# Altium schematic sheet atxmega64.SchDoc
size B
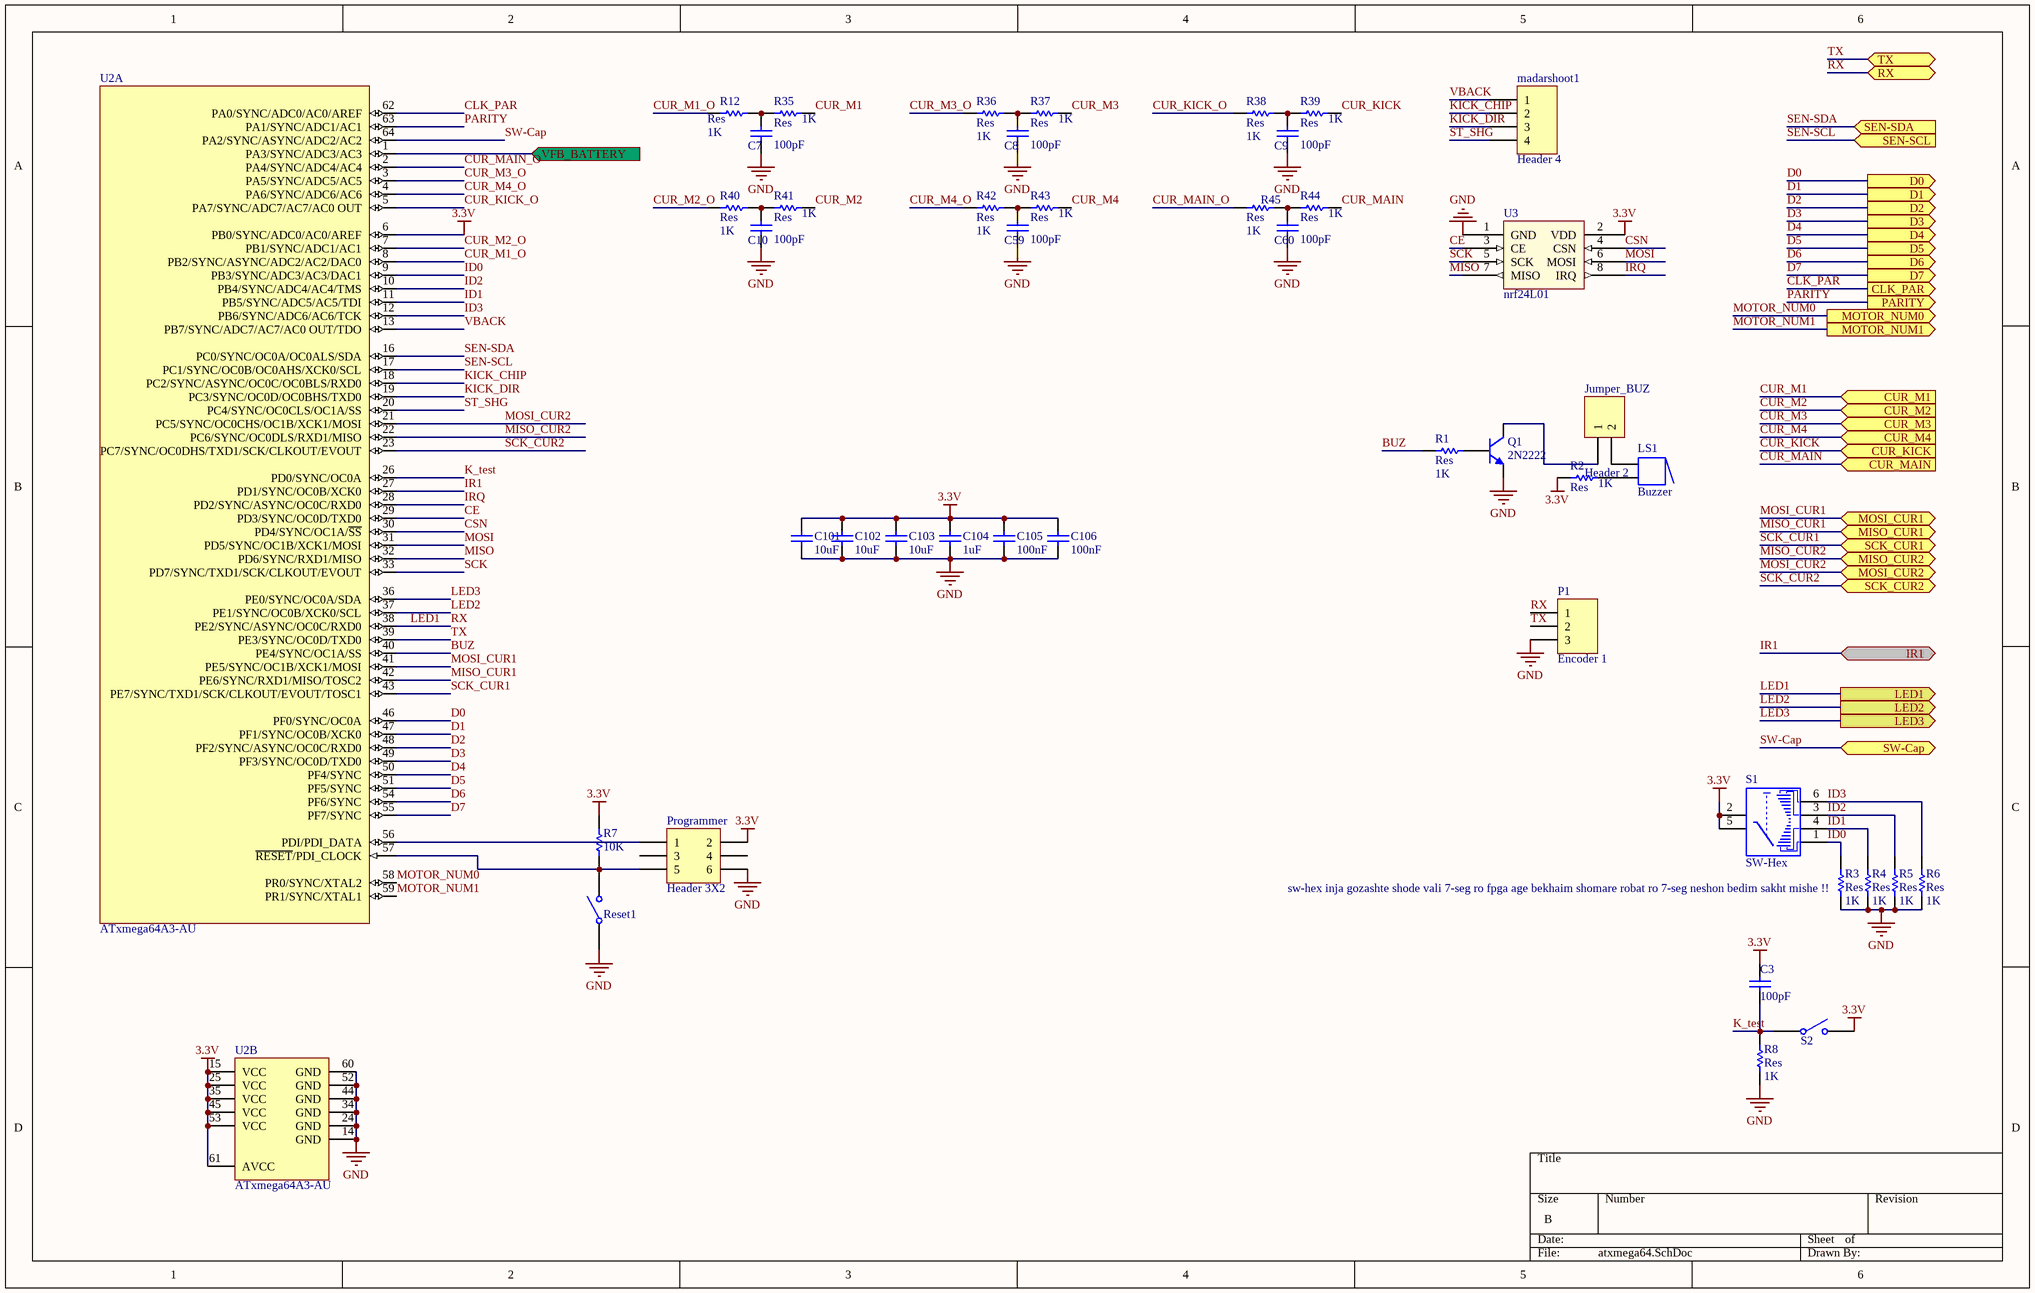
[diagram p0: atxmega64.SchDoc]

## Parts
C3  value 100pF  [2012[0805]]  (hidden comment: Cap_UP)
C7  value 100pF  [2012[0805]]  (hidden comment: Cap_UP)
C8  value 100pF  [2012[0805]]  (hidden comment: Cap_UP)
C9  value 100pF  [2012[0805]]  (hidden comment: Cap_UP)
C10  value 100pF  [2012[0805]]  (hidden comment: Cap_UP)
C59  value 100pF  [2012[0805]]  (hidden comment: Cap_UP)
C60  value 100pF  [2012[0805]]  (hidden comment: Cap_UP)
C101  value 10uF  [2012[0805]]  (hidden comment: Cap_UP)
C102  value 10uF  [2012[0805]]  (hidden comment: Cap_UP)
C103  value 10uF  [2012[0805]]  (hidden comment: Cap_UP)
C104  value 1uF  [2012[0805]]  (hidden comment: Cap_UP)
C105  value 100nF  [2012[0805]]  (hidden comment: Cap_UP)
C106  value 100nF  [2012[0805]]  (hidden comment: Cap_UP)
Jumper_BUZ  Header 2  [HDR1X2]
LS1  Buzzer  [BUZZER]
madarshoot1  Header 4  [sucket-smd-4pin]
P1  Encoder 1  [HDR1X3A]
Programmer  Header 3X2  [HDRBOX2X3]
Q1  2N2222  [SOT-23]
R1  Res  value 1K  [2012[0805]]
R2  Res  value 1K  [2012[0805]]
R3  Res  value 1K  [2012[0805]]
R4  Res  value 1K  [2012[0805]]
R5  Res  value 1K  [2012[0805]]
R6  Res  value 1K  [2012[0805]]
R7  10K  [2012[0805]]
R8  Res  value 1K  [2012[0805]]
R12  Res  value 1K  [2012[0805]]
R35  Res  value 1K  [2012[0805]]
R36  Res  value 1K  [2012[0805]]
R37  Res  value 1K  [2012[0805]]
R38  Res  value 1K  [2012[0805]]
R39  Res  value 1K  [2012[0805]]
R40  Res  value 1K  [2012[0805]]
R41  Res  value 1K  [2012[0805]]
R42  Res  value 1K  [2012[0805]]
R43  Res  value 1K  [2012[0805]]
R44  Res  value 1K  [2012[0805]]
R45  Res  value 1K  [2012[0805]]
Reset1  SW-SPST  [PUSH-BUT]  (value not drawn)
S1  SW-Hex  [SW-HEX]
S2  SW-SPST  [PUSH-BUT]  (value not drawn)
U2  ATxmega64A3-AU  [64A_N]  (parts A,B of 2)
U3  nrf24L01  [NRF24L01]

## Ports
CLK_PAR (out), CUR_KICK (in), CUR_M1 (in), CUR_M2 (in), CUR_M3 (in), CUR_M4 (in), CUR_MAIN (in), D0 (out), D1 (out), D2 (out), D3 (out), D4 (out), D5 (out), D6 (out), D7 (out), IR1, LED1 (out), LED2 (out), LED3 (out), MISO_CUR1, MISO_CUR2, MOSI_CUR1, MOSI_CUR2, MOTOR_NUM0 (out), MOTOR_NUM1 (out), PARITY (out), RX, SCK_CUR1, SCK_CUR2, SEN-SCL (in), SEN-SDA (in), SW-Cap, TX, VFB_BATTERY (in)

## Nets
3.3V: C3.2 C101.2 C102.2 C103.2 C104.2 C105.2 C106.2 Programmer.2 R2.1 R7.1 S1.2 S1.5 S2.2(NO) U2.6(PB0/SYNC/ADC0/AC0/AREF) U2.15(VCC) U2.25(VCC) U2.35(VCC) U2.45(VCC) U2.53(VCC) U2.61(AVCC) U3.2(VDD)
GND: C7.1 C8.1 C9.1 C10.1 C59.1 C60.1 C101.1 C102.1 C103.1 C104.1 C105.1 C106.1 P1.3 Programmer.6 Q1.3(E) R3.1 R4.1 R5.1 R6.1 R8.2 Reset1.1(COMMON) U2.14(GND) U2.24(GND) U2.34(GND) U2.44(GND) U2.52(GND) U2.60(GND) U3.1(GND)
BUZ: R1.1 U2.40(PE4/SYNC/OC1A/SS)
CE: U2.29(PD3/SYNC/OC0D/TXD0) U3.3(CE)
CLK_PAR: U2.62(PA0/SYNC/ADC0/AC0/AREF) ; port CLK_PAR
CSN: U2.30(PD4/SYNC/OC1A/~{SS}) U3.4(CSN)
CUR_KICK: R39.2 ; port CUR_KICK
CUR_KICK_O: R38.1 U2.5(PA7/SYNC/ADC7/AC7/AC0_OUT)
CUR_M1: R35.2 ; port CUR_M1
CUR_M1_O: R12.1 U2.8(PB2/SYNC/ASYNC/ADC2/AC2/DAC0)
CUR_M2: R41.2 ; port CUR_M2
CUR_M2_O: R40.1 U2.7(PB1/SYNC/ADC1/AC1)
CUR_M3: R37.2 ; port CUR_M3
CUR_M3_O: R36.1 U2.3(PA5/SYNC/ADC5/AC5)
CUR_M4: R43.2 ; port CUR_M4
CUR_M4_O: R42.1 U2.4(PA6/SYNC/ADC6/AC6)
CUR_MAIN: R44.2 ; port CUR_MAIN
CUR_MAIN_O: R45.1 U2.2(PA4/SYNC/ADC4/AC4)
D0: U2.46(PF0/SYNC/OC0A) ; port D0
D1: U2.47(PF1/SYNC/OC0B/XCK0) ; port D1
D2: U2.48(PF2/SYNC/ASYNC/OC0C/RXD0) ; port D2
D3: U2.49(PF3/SYNC/OC0D/TXD0) ; port D3
D4: U2.50(PF4/SYNC) ; port D4
D5: U2.51(PF5/SYNC) ; port D5
D6: U2.54(PF6/SYNC) ; port D6
D7: U2.55(PF7/SYNC) ; port D7
ID0: R3.2 S1.1 U2.9(PB3/SYNC/ADC3/AC3/DAC1)
ID1: R4.2 S1.4 U2.11(PB5/SYNC/ADC5/AC5/TDI)
ID2: R5.2 S1.3 U2.10(PB4/SYNC/ADC4/AC4/TMS)
ID3: R6.2 S1.6 U2.12(PB6/SYNC/ADC6/AC6/TCK)
IR1: U2.27(PD1/SYNC/OC0B/XCK0) ; port IR1
IRQ: U2.28(PD2/SYNC/ASYNC/OC0C/RXD0) U3.8(IRQ)
K_test: C3.1 R8.1 S2.1(COMMON) U2.26(PD0/SYNC/OC0A)
KICK_CHIP: madarshoot1.2 U2.18(PC2/SYNC/ASYNC/OC0C/OC0BLS/RXD0)
KICK_DIR: madarshoot1.3 U2.19(PC3/SYNC/OC0D/OC0BHS/TXD0)
LED1: P1.1 U2.38(PE2/SYNC/ASYNC/OC0C/RXD0) ; port LED1, port RX  [also labelled RX]
LED2: U2.37(PE1/SYNC/OC0B/XCK0/SCL) ; port LED2
LED3: U2.36(PE0/SYNC/OC0A/SDA) ; port LED3
MISO: U2.32(PD6/SYNC/RXD1/MISO) U3.7(MISO)
MISO_CUR1: U2.42(PE6/SYNC/RXD1/MISO/TOSC2) ; port MISO_CUR1
MISO_CUR2: U2.22(PC6/SYNC/OC0DLS/RXD1/MISO) ; port MISO_CUR2
MOSI: U2.31(PD5/SYNC/OC1B/XCK1/MOSI) U3.6(MOSI)
MOSI_CUR1: U2.41(PE5/SYNC/OC1B/XCK1/MOSI) ; port MOSI_CUR1
MOSI_CUR2: U2.21(PC5/SYNC/OC0CHS/OC1B/XCK1/MOSI) ; port MOSI_CUR2
MOTOR_NUM0: U2.58(PR0/SYNC/XTAL2) ; port MOTOR_NUM0
MOTOR_NUM1: U2.59(PR1/SYNC/XTAL1) ; port MOTOR_NUM1
PARITY: U2.63(PA1/SYNC/ADC1/AC1) ; port PARITY
SCK: U2.33(PD7/SYNC/TXD1/SCK/CLKOUT/EVOUT) U3.5(SCK)
SCK_CUR1: U2.43(PE7/SYNC/TXD1/SCK/CLKOUT/EVOUT/TOSC1) ; port SCK_CUR1
SCK_CUR2: U2.23(PC7/SYNC/OC0DHS/TXD1/SCK/CLKOUT/EVOUT) ; port SCK_CUR2
SEN-SCL: U2.17(PC1/SYNC/OC0B/OC0AHS/XCK0/SCL) ; port SEN-SCL
SEN-SDA: U2.16(PC0/SYNC/OC0A/OC0ALS/SDA) ; port SEN-SDA
ST_SHG: madarshoot1.4 U2.20(PC4/SYNC/OC0CLS/OC1A/SS)
SW-Cap: U2.64(PA2/SYNC/ASYNC/ADC2/AC2) ; port SW-Cap
TX: P1.2 U2.39(PE3/SYNC/OC0D/TXD0) ; port TX
VBACK: madarshoot1.1 U2.13(PB7/SYNC/ADC7/AC7/AC0_OUT/TDO)
VFB_BATTERY: U2.1(PA3/SYNC/ADC3/AC3) ; port VFB_BATTERY
NetC7_2: C7.2 R12.2 R35.1
NetC8_2: C8.2 R36.2 R37.1
NetC9_2: C9.2 R38.2 R39.1
NetC10_2: C10.2 R40.2 R41.1
NetC59_2: C59.2 R42.2 R43.1
NetC60_2: C60.2 R44.1 R45.2
NetJumper_BUZ_1: Jumper_BUZ.1 Q1.1(C)
NetJumper_BUZ_2: Jumper_BUZ.2 LS1.1
NetLS1_2: LS1.2 R2.2
NetProgrammer_1: Programmer.1 U2.56(PDI/PDI_DATA)
NetProgrammer_5: Programmer.5 R7.2 Reset1.2(NO) U2.57(~{RESET}/PDI_CLOCK)
NetQ1_2: Q1.2(B) R1.2

Not connected (* = marked no-connect by the designer): Programmer 3 4

## Notes on the sheet
- sw-hex inja gozashte shode vali 7-seg ro fpga age bekhaim shomare robat ro 7-seg neshon bedim sakht mishe !!

## Library data of the parts
C3 C7-C10 C59 C60 C101-C106 = Cap_UP: Capacitor; Published: 8-Jun-2000; LatestRevisionDate: 17-Jul-2002; LatestRevisionNote: Re-released for DXP Platform.; PackageReference: RAD-0.3; Publisher: Altium Limited
Jumper_BUZ = Header 2: Header, 2-Pin; LatestRevisionDate: 17-Jul-2002; LatestRevisionNote: Re-released for DXP Platform.; Publisher: Altium Limited
LS1 = Buzzer: Magnetic Transducer Buzzer; Published: 24-Mar-1999; LatestRevisionDate: 17-Dec-2003; LatestRevisionNote: Schematic revised, PCB Footprint replaced.; DatasheetDocument: 17-Dec-2003; PackageReference: ABSM-1574; Publisher: Altium Limited; ComponentLink1Description: Manufacturer Link; ComponentLink1URL: http://www.megastar.com/linecard/buzzmode/index.php
madarshoot1 = Header 4: Header, 4-Pin; LatestRevisionDate: 17-Jul-2002; LatestRevisionNote: Re-released for DXP Platform.; Publisher: Altium Limited
P1 = Header 3: Header, 3-Pin; LatestRevisionDate: 17-Jul-2002; LatestRevisionNote: Re-released for DXP Platform.; Publisher: Altium Limited
Programmer = Header 3X2: Header, 3-Pin, Dual row; LatestRevisionDate: 17-Jul-2002; LatestRevisionNote: Re-released for DXP Platform.; Publisher: Altium Limited
Q1 = 2N2222: NPN Bipolar Transistor; Published: 8-Jun-2000; LatestRevisionDate: 17-Jul-2002; LatestRevisionNote: Re-released for DXP Platform.; PackageReference: TO-226; Publisher: Altium Limited; Code_JEDEC: TO-226-AA
R1-R8 R12 R35-R45 = Res: Semiconductor Resistor; Published: 8-Jun-2000; LatestRevisionDate: 17-Jul-2002; LatestRevisionNote: Re-released for DXP Platform.; PackageReference: AXIAL-0.5; Publisher: Altium Limited
Reset1 S2 = SW-SPST: Single-Pole, Single-Throw Switch; Published: 24-Mar-1999; Revision: July-2002: Re-released for DXP Platform.; Publisher: Altium Limited
U2 = ATxmega64A3-AU: 8/16-bit AVR XMEGA A3 Microcontroller, 1.6-3.6V, 64KB + 4KB Flash, 2KB EEPROM, 4KB SRAM, 64-pin TQFP, Industrial Grade (-40°C to 85°C), Pb-Free; Published: 1-Apr-2010; DatasheetVersion: revQ, Feb-2010; PackageVersion: revB, Oct-2001; PackageReference: 64A; Publisher: Altium Limited; PackageDescription: 64-Pin Plastic Thin Profile Quad Flat Pack, 14 x 14 x 1.0 mm Body, 0.8 mm Pitch (TQFP); Supplier 1: Digi-Key; Supplier Part Number 1: ATXMEGA64A3-AU-ND; Supplier 2: Farnell; Supplier Part Number 2: 1748559; Supplier 3: Mouser; Supplier Part Number 3: 556-ATXMEGA64A3-AU; Code_JEDEC: MS-026-AEB; ComponentLink1Description: Manufacturer Link; ComponentLink1URL: http://www.atmel.com/products/avr/default.asp?; ComponentLink2Description: ATxmega64A3/128A3/192A3/256A3 Datasheet; ComponentLink2URL: http://www.atmel.com/dyn/resources/prod_documents/doc8068.pdf; ComponentLink3Description: Atmel.com Home; ComponentLink3URL: http://www.atmel.com
S1 = SW-Hex: Published: 24-Mar-1999; LatestRevisionDate: 17-Jul-2002; LatestRevisionNote: Re-released for DXP Platform.; PackageReference: DIP-8; Publisher: Altium Limited